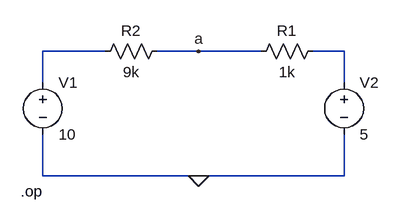
[diagram p0: schematic Circuit2.asc]
Circuit2.asc, the LTspice schematic file:
Version 4
SHEET 1 880 680
WIRE 32 80 -64 80
WIRE 176 80 112 80
WIRE 272 80 176 80
WIRE 400 80 352 80
WIRE -64 128 -64 80
WIRE 400 128 400 80
WIRE -64 272 -64 208
WIRE 176 272 -64 272
WIRE 400 272 400 208
WIRE 400 272 176 272
FLAG 176 80 a
FLAG 176 272 0
SYMBOL voltage -64 112 R0
SYMATTR InstName V1
SYMATTR Value 10
SYMBOL voltage 400 112 R0
SYMATTR InstName V2
SYMATTR Value 5
SYMBOL res 368 64 R90
WINDOW 0 0 56 VBottom 2
WINDOW 3 32 56 VTop 2
SYMATTR InstName R1
SYMATTR Value 1k
SYMBOL res 128 64 R90
WINDOW 0 0 56 VBottom 2
WINDOW 3 32 56 VTop 2
SYMATTR InstName R2
SYMATTR Value 9k
TEXT -98 296 Left 2 !.op

The netlist it stands for:
* Circuit2.asc
V1 N001 0 10
V2 N002 0 5
R1 N002 a 1k
R2 a N001 9k
.op
.backanno
.end